# Altium schematic sheet Fuente 0-30V 0-2A.Sheet .SchDoc
size A4
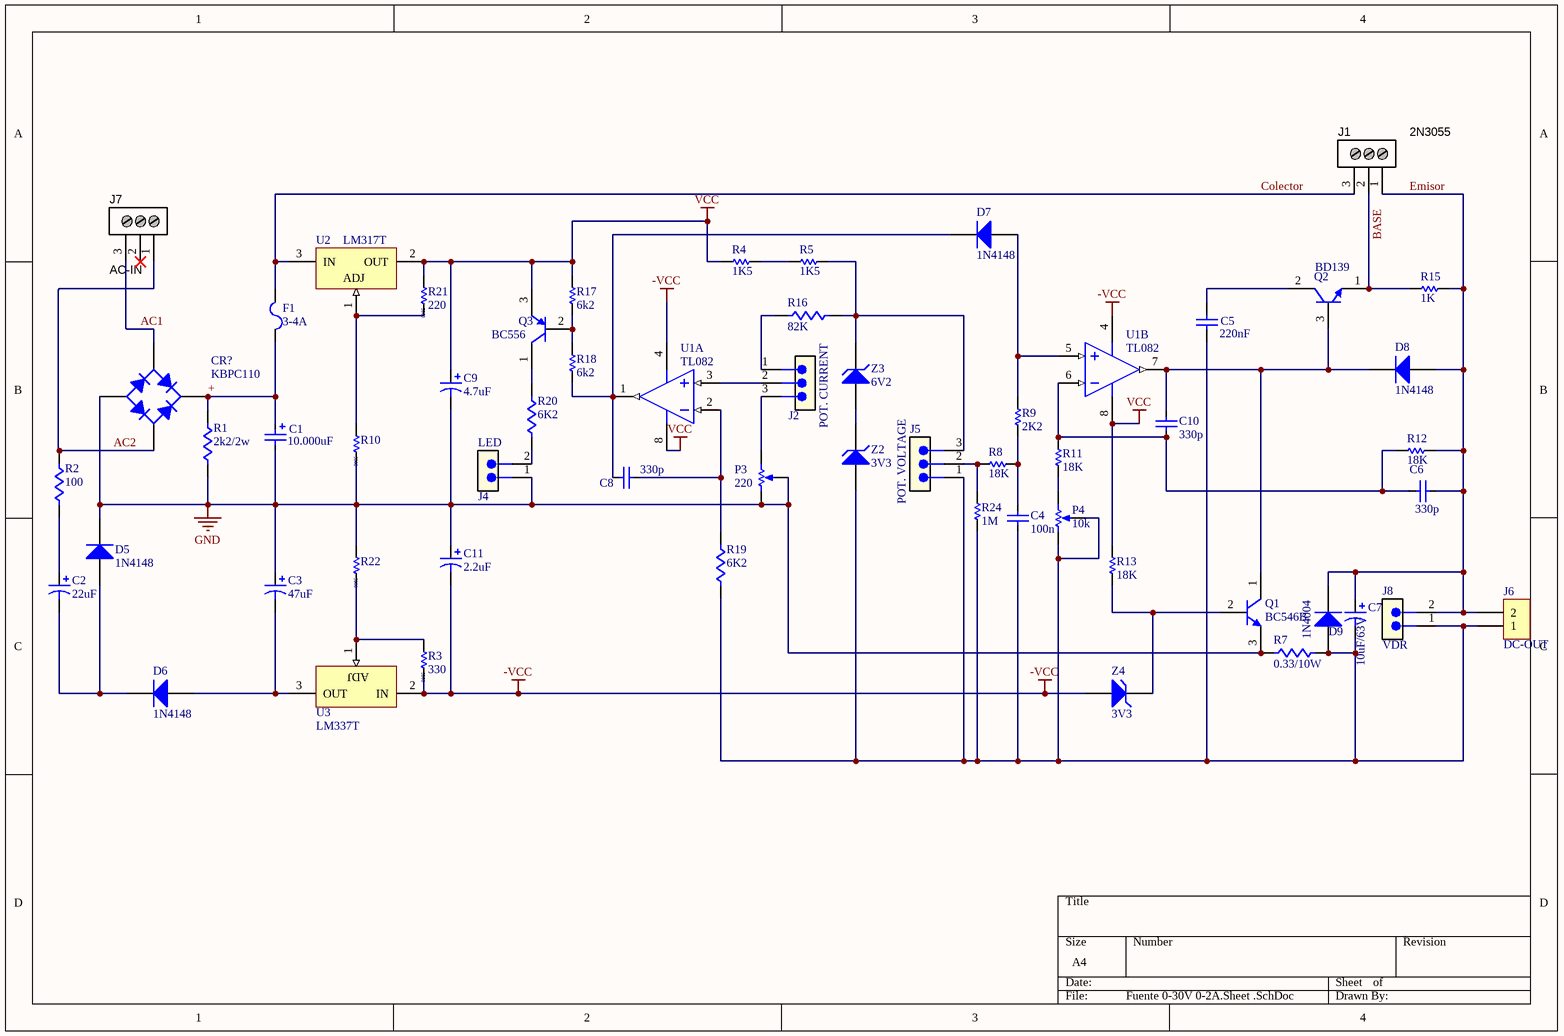
[diagram p0: Fuente 0-30V 0-2A.Sheet .SchDoc]

## Parts
C1  10.000uF  [C10000uF]
C2  22uF  [A]
C3  47uF  [A]
C4  100n  [0805 - CAP]
C5  220nF  [VP31-2.5]
C6  330p  [0805 - CAP]
C7  10uF/63V  [A]
C8  330p  [0805 - CAP]
C9  4.7uF  [A]
C10  330p  [0805 - CAP]
C11  2.2uF  [A]
CR?  KBPC110  [D-46_3A]
D5  1N4148  [GRZZ0002ZB-A]
D6  1N4148  [GRZZ0002ZB-A]
D7  1N4148  [GRZZ0002ZB-A]
D8  1N4148  [GRZZ0002ZB-A]
D9  1N4004  [GRZZ0002ZB-A]
F1  3-4A  [FUSE]
J1  Supplier Part Number 1: 2N3055  [3P_PCB_ScrewTerm_90S_3.81MM]  (hidden comment: Stackable ScrewTerm)
J2  POT. CURRENT  [HEADER3X1]
J4  LED  [HEADER2X1]
J5  POT. VOLTAGE  [HEADER3X1]
J6  DC-OUT  [CONECTEUR 2POS - duplicate]
J7  Supplier Part Number 1: AC-IN  [3P_PCB_ScrewTerm_90S_3.81MM]  (hidden comment: Stackable ScrewTerm)
J8  VDR  [HEADER2X1]
P3  value 220  [VR5]  (hidden comment: RPot)
P4  value 10k  [VR5]  (hidden comment: RPot)
Q1  BC546B  [ONSC-TO-92-3-29-11]
Q2  BD139  [ONSC-TO-225-3-77-09]
Q3  BC556  [ONSC-TO-92-3-29-11]
R1  2k2/2w  [Res 10K]
R2  100  [Res 10K]
R3  330  Package: 0805  [0805 - RES]
R4  1K5  [0805 - RES]
R5  1K5  [0805 - RES]
R7  Resistance: 0.33/10W  [Resistor_poten]  (hidden comment: POTENCIA)
R8  18K  [0805 - RES]
R9  2K2  [0805 - RES]
R10  Package: 0805  [0805 - RES]
R11  18K  [0805 - RES]
R12  18K  [0805 - RES]
R13  18K  [0805 - RES]
R15  1K  [0805 - RES]
R16  82K  [res5mm]
R17  6k2  [0805 - RES]
R18  6k2  [0805 - RES]
R19  6K2  [res5mm]
R20  6K2  [res5mm]
R21  220  Package: 0805  [0805 - RES]
R22  Package: 0805  [0805 - RES]
R24  1M  [0805 - RES]
U1  TL082  [TI-P8]  (parts A,B of 2)
U2  LM317T  [T03B]
U3  LM337T  [T03B]
Z2  3V3  [GRZZ0002ZB-A]
Z3  6V2  [GRZZ0002ZB-A]
Z4  3V3  [GRZZ0002ZB-A]

## Nets
-VCC: C11.2 R3.1 U1.4(VCC-) U3.2(IN) Z4.2(A)
GND: C1.1 C3.1 C9.2 C11.1 CR?.3(A) D5.1(K) J4.1 P3.1 P3.2 Q1.3(E) R1.2 R7.2 R10.1 R22.2
VCC: C9.1 Q3.3(E) R4.2 R13.1 R17.2 R21.2 U1.8(VCC+) U2.2(OUT)
+: C1.2 CR?.1(K) F1.1 R1.1
AC1: CR?.4(C) J7.3
AC2: CR?.2(C) J7.1 R2.1
BASE: J1.2 Q2.1(E) R15.1
Colector: F1.2 J1.3 U2.3(IN)
Emisor: C6.2 C7.1 D8.2(A) D9.1(K) J1.1 J6.2 J8.2 R12.2 R15.2
NetC2_1: C2.1 R2.2
NetC2_2: C2.2 D5.2(A) D6.1(K)
NetC3_2: C3.2 D6.2(A) U3.3(OUT)
NetC4_1: C4.1 C5.1 C7.2 D9.2(A) J5.1 J6.1 J8.1 P4.1 P4.2 R7.1 R19.1 R24.2 Z2.2(A)
NetC4_2: C4.2 R8.1 R9.2
NetC5_2: C5.2 Q2.2(C)
NetC6_1: C6.1 C10.1 R11.1 R12.1 U1.6(IN2-)
NetC8_1: C8.1 D7.1(K) R18.1 U1.1(OUT1)
NetC8_2: C8.2 R19.2 U1.2(IN1-)
NetC10_2: C10.2 D8.1(K) Q1.1(C) Q2.3(B) U1.7(OUT2)
NetD7_2: D7.2(A) R9.1 U1.5(IN2+)
NetJ2_1: J2.1 R16.1
NetJ2_2: J2.2 U1.3(IN1+)
NetJ2_3: J2.3 P3.3
NetJ4_2: J4.2 R20.1
NetJ5_2: J5.2 R8.2 R24.1
NetJ5_3: J5.3 R5.1 R16.2 Z3.1(K)
NetP4_3: P4.3 R11.2
NetQ1_2: Q1.2(B) R13.2 Z4.1(K)
NetQ3_1: Q3.1(C) R20.2
NetQ3_2: Q3.2(B) R17.1 R18.2
NetR3_2: R3.2 R22.1 U3.1(ADJ)
NetR4_1: R4.1 R5.2
NetR10_2: R10.2 R21.1 U2.1(ADJ)
NetZ2_1: Z2.1(K) Z3.2(A)

Not connected (* = marked no-connect by the designer): J7 2*

## Library data of the parts
C1 = CAPE 10000uF: CAPACITANCE: C?; VOLTAGE: V
C2 C3 C7 C9 C11 = 94SC105X0016ABP: Solid Aluminum Capacitor with Organic Semiconductor Electrolyte: 1uF, 16V, Bulk Pack; Note: Part Numbers shown are for ± 20% capacitance tolerance (X0).; PCB_Layout: Complies with Manufacturer's Recommendation.; DrillSize: Nominal, Rounded to the nearest 0.1mm; Published: 19-Mar-2004; DatasheetDocument: 23-May-2001; PackageReference: A; Publisher: Altium Limited; ComponentLink1Description: Manufacturer Link; ComponentLink1URL: http://www.vishay.com/; ComponentLink2Description: Datasheet; ComponentLink2URL: http://www.vishay.com/docs/90004/94sc.pdf; Value: 1uF
C4 C6 C8 C10 = CAP_0805: Package: 0805
C5 = VP31BA100JA: Dipped Radial Multilayer Ceramic Capacitor COG (NPO): 10pF, 50/63V; Note: See Datasheet for other packages & tolerances; Published: 17-Dec-2003; DatasheetDocument: 2-Jan-2002; PackageDocument: 8-Feb-2002; PackageReference: VP31-2.5; Publisher: Altium Limited; ComponentLink1Description: Manufacturer Link; ComponentLink1URL: http://www.vishay.com/; Value: 10pF
CR? = KBPC110: 3 Amp Single Phase Rectifier Bridge; Published: 8-Jun-2000; LatestRevisionDate: 17-Jul-2002; LatestRevisionNote: Re-released for DXP Platform.; DatasheetVersion: E2574A; PackageReference: D-46_3A; Publisher: Altium Limited; PackageDescription: Bridge Rectifier; 4 Terminals; Body 16.8 x 16.8 mm (typ); Pitch 10.67 mm; ComponentLink1Description: Manufacturer Link; ComponentLink1URL: http://www.irf.com/; ComponentLink2Description: Datasheet; ComponentLink2URL: http://www.irf.com/product-info/datasheets/data/kbpc1.pdf
D5-D9 = 1N4148: Silicon Epitaxial Planar Diode for Various Detector, Modulator, Demodulator; Published: 12-Feb-2010; DatasheetVersion: Rev.5.00, Jul-2006; PackageVersion: Aug-2005; PackageReference: GRZZ0002ZB-A; Publisher: Altium Limited; PackageDescription: Diode, Axial; Body 4.2 x 2.0 mm (LxDia.), Lead Dia. 0.5 mm (nom); Code_JEITA: SC-40; ComponentLink1Description: Manufacturer Link; ComponentLink1URL: http://sg.renesas.com/fmwk.jsp?cnt=diode_landing.jsp&fp=/products/discrete/diodes/; ComponentLink2Description: Datasheet; ComponentLink2URL: http://documentation.renesas.com/eng/products/diode/rej03g0556_1n4148.pdf; ComponentLink3Description: Packaging Specification; ComponentLink3URL: http://sg.renesas.com/media/products/common_info/package/pdf/diode/code/grzz0002zb_a.pdf
F1 = FUSE: FUSE_GENERIC_RADIAL
J1 J7 = BOR 1X3: Terminal Block Screw Type THT 2-Position 3.81mm pitch; Manufacturer 1: Tyco Electronics; Manufacturer Part Number 1: 1776113-2; Value: 2 position; Pitch: 0.150" (3.81mm); Positions Per Level: 2; Package / Case: Side Entry; 3.81mm pitch; Category: Connectors Interconnects; Color: Black; Supplier 1: Digi-Key
J2 J5 = HEADER 3X1
J4 J8 = HEADER 2X1: Header recto M 100 mils pitch 2x1; Manufacturer: Harwin; PartNumber: M20-9 73 02 46; ComponentStatus: Active; Contacts: 2; EM_Case: NA; Gender: Male; Imax: 3 A; INVAPDescriptionEN: Header, Male, Male, 2, NA; INVAPDescriptionES: Header, Macho, Male, 2, NA; Notes: Corresponde a corte de una tira de 40, se utilizará el equivalente disponible en depósito, HDSIF19040GT; SolderingType: Manual; SubTypeES: Macho; Vmax: 800 V; Case: NA; Category: Conventional; DatasheetURL: https://cdn.harwin.com/pdfs/Harwin_PC_Connectors_M20.pdf; EM_Manufacturer: NA; EM_Mfr_PartNum: NA; EM_Mfr_Reel_PartNum: NA; FM_Case: NA; FM_Manufacturer: NA; FM_Mfr_PartNum: NA; FM_Mfr_Reel_PartNum: NA; Footprint_INVAP: HEADER2X1; MilitarySTD: NA; Mil_PartNum: NA; MountingType: TH; Reel_PartNumber: NA; SubTypeEN: Male; TempMax: 105 °C; TempMin: -40 °C; TypeEN: Header; TypeES: Header; Weight: 0,12 gr; CM_Case: NA; CM_Manufacturer: Harwin; CM_Mfr_PartNum: M20-9 73 02 46; CM_Mfr_Reel_PartNum: NA; CM_Notes: Corresponde a corte de una tira de 40, se utilizará el equivalente disponible en depósito, HDSIF19040GT; EM_Notes: NA; FM_Notes: NA
J6 = CON 1x2: CONECTOR 2P
P3 P4 = RPot: Potentiometer; Sim Note: Enter the Resistance value and the set point into parameter fields.; Set Position: 0.5; Published: 8-Jun-2000; LatestRevisionDate: 17-Jul-2002; LatestRevisionNote: Re-released for DXP Platform.; PackageReference: VR5; Publisher: Altium Limited
Q1 = BC546B: Amplifier Transistor, NPN Silicon, 3-Pin TO-92, Bulk Box; Manufacturer: On Semiconductor; Note: 0; fT Min (MHz): 150; IC Continuous (A): 0.1; DatasheetVersion: Rev. 7; PackageVersion: Rev. AM; PackageReference: TO-92-3-29-11_AM_SL; PackageDescription: 3-Pin Transistor Outline, Body 4.825 x 3.685 mm, Pitch 1.27 mm; Packing: Bulk Box; Polarity: NPN; RoHS: FALSE; Mounting Technology: Through Hole; PartNumber: BC546B; ComponentLink1Description: Manufacturer URL; ComponentLink1URL: http://www.onsemi.com/; ComponentLink2Description: Datasheet; ComponentLink2URL: http://www.onsemi.com/pub_link/Collateral/BC546-D.PDF; ComponentLink3Description: Package Specification; ComponentLink3URL: http://www.onsemi.cn/pub_link/Collateral/2N6426-D.PDF
Q2 = BD139: Plastic Medium-Power Silicon NPN Transistor, 3-Pin TO-225, Bulk Box; Manufacturer: On Semiconductor; IC Continuous (A): 1.5; DatasheetVersion: Rev. 16; PackageVersion: Rev. AC, 12/2013; PackageReference: TO-225-3-77-09; PackageDescription: 3-Pin Flange Mount, Vertical Straight Lead, Body 7.6 x 2.7 mm, Pitch 2.29 mm; Supplier 1: Digi-Key; Supplier Part Number 1: BD139OS-ND; Packing: Bulk Box; Polarity: NPN; RoHS: FALSE; Mounting Technology: Through Hole; PartNumber: BD139; ComponentLink1Description: Manufacturer URL; ComponentLink1URL: http://www.onsemi.com/; ComponentLink2Description: Datasheet; ComponentLink2URL: http://www.onsemi.com/pub_link/Collateral/BD135-D.PDF; ComponentLink3Description: Package Specification; ComponentLink3URL: http://www.onsemi.com/pub_link/Collateral/77-09.PDF
Q3 = BC556BG: Amplifier Transistor, PNP Silicon, 3-Pin TO-92, Pb-Free, Bulk Box; Manufacturer: On Semiconductor; IC Continuous (A): -0.1; DatasheetVersion: Rev. 3; PackageVersion: Rev. AM; PackageReference: TO-92-3-29-11_AM_SL; PackageDescription: 3-Pin Transistor Outline, Body 4.825 x 3.685 mm, Pitch 1.27 mm; Supplier 1: Digi-Key; Supplier Part Number 1: BC556BGOS-ND; Supplier 2: Newark; Supplier Part Number 2: 26K3439; Supplier 3: Mouser; Supplier Part Number 3: 863-BC556BG; Packing: Bulk Box; Polarity: PNP; RoHS: TRUE; Mounting Technology: Through Hole; PartNumber: BC556BG; ComponentLink1Description: Manufacturer URL; ComponentLink1URL: http://www.onsemi.com/; ComponentLink2Description: Datasheet; ComponentLink2URL: http://www.onsemi.com/pub_link/Collateral/BC556B-D.PDF; ComponentLink3Description: Package Specification; ComponentLink3URL: http://www.onsemi.cn/pub_link/Collateral/2N6426-D.PDF
R1 R2 = Res 10K: R1206; Tolerance: %; Power: W; Package: 1206
  R1: Resistance: 2k2/2w
  R2: Resistance: 100
R3-R5 R8-R13 R15 R17 R18 R21 R22 R24 = RES_0805
  R4 R5 R8 R9 R11-R13 R15 R17 R18 R24: Package: 0805
R7 = RES_POTEN: R1206; Tolerance: %; Power: W; Package: 1206
R16 R19 R20 = Res 5mm: 5mm; Tolerance: %; Power: W; Package: 1206
  R16: Resistance: 82K
  R19 R20: Resistance: 6K2
U1 = TL082ACP: JFET-Input Operational Amplifier, 7 to 36 V, 0 to 70 degC, 8-pin DIP (P8), Pb-Free (RoHS); Manufacturer: Texas Instruments; CMRR(Min)(dB): 75; GBW(Typ)(MHz): 3; IIB(Max)(pA): 200; Iq per channel(Max)(mA): 2.8; Number of Channels: 2; Offset Drift(Typ)(uV/C): 18; Rating: Catalog; Slew Rate(Typ)(V/us): 13; Sub Family: General Purpose Amplifier, High Supply Voltage Amplifier (>=30V); Total Supply Voltage(Max)(+5V is 5, +/-5V is 10): 36; Total Supply Voltage(Min)(+5V is 5, +/-5V is 10): 7; Vio (25C)(Max)(mV): 6; DatasheetVersion: SLOS081G; PackageVersion: 4040082/E, 04/2010; PackageReference: P8; PackageDescription: 8-Pin Plastic In-Line, Body 9.59 x 6.35 mm, Pitch 2.54 mm; Supplier 1: Digi-Key; Supplier Part Number 1: 296-1778-5-ND; Supplier 2: Farnell; Supplier Part Number 2: 1103189; Supplier 3: Newark; Supplier Part Number 3: 08F9330; Supplier 4: Mouser; Supplier Part Number 4: 595-TL082ACP; Eco-Plan: Pb-Free (RoHS); Vn at 1kHz(Typ)(nV/rtHz): 18; Mounting Technology: Through Hole; Code_JEDEC: MS-001; PartNumber: TL082ACP; ComponentLink1Description: Manufacturer URL; ComponentLink1URL: http://www.ti.com/; ComponentLink2Description: Datasheet; ComponentLink2URL: http://www.ti.com/lit/ds/symlink/tl082a.pdf; ComponentLink3Description: Package Specification; ComponentLink3URL: http://www.ti.com/litv/pdf/mpdi001b
U2 = LM317T: 3-Terminal Adjustable Regulator, 3-pin TO-220; Manufacturer: National Semiconductor; PackageTopMarking: NSUZXYTTE#*LM317T P+; PowerWise: N; CompType: LDO IC; High-Reliability: Y; DatasheetVersion: Apr-2007; PackageVersion: revL, Jan-1992; PackageReference: T03B; PackageDescription: TO-220, Molded, 3 Lead, Straight; PartNumber: LM317T; RoHS: N; PinCount: 3; ComponentLink1Description: Manufacturer URL; ComponentLink1URL: http://www.national.com/; ComponentLink2Description: LM317 Datasheet; ComponentLink2URL: http://www.national.com/ds/LM/LM317.pdf; ComponentLink3Description: LM317 Web Page; ComponentLink3URL: http://www.national.com/pf/LM/LM317.html; ComponentLink4Description: T03B Package Page; ComponentLink4URL: http://www.national.com/packaging/folders/t03b.html
U3 = LM337T: 3-Terminal Adjustable Negative Regulator, 3-pin TO-220; Manufacturer: National Semiconductor; PackageTopMarking: NSUZXYTTE#*LM337T P+; PowerWise: N; CompType: LDO IC; High-Reliability: Y; DatasheetVersion: Nov-2004; PackageVersion: revL, Jan-1992; PackageReference: T03B; PackageDescription: TO-220, Molded, 3 Lead, Straight; PartNumber: LM337T; RoHS: N; PinCount: 3; ComponentLink1Description: Manufacturer URL; ComponentLink1URL: http://www.national.com/; ComponentLink2Description: LM337 Datasheet; ComponentLink2URL: http://www.national.com/ds/LM/LM337.pdf; ComponentLink3Description: LM337 Web Page; ComponentLink3URL: http://www.national.com/pf/LM/LM337.html; ComponentLink4Description: T03B Package Page; ComponentLink4URL: http://www.national.com/packaging/folders/t03b.html
Z2-Z4 = HZ2C1-N: Silicon Planar Zener Diode for Stabilized Power Supply; Published: 12-Feb-2010; DatasheetVersion: Rev.1.00, Mar-2008; PackageVersion: Aug-2005; PackageReference: GRZZ0002ZB-A; Publisher: Altium Limited; PackageDescription: Diode, Axial; Body 4.2 x 2.0 mm (LxDia.), Lead Dia. 0.5 mm (nom); Code_JEITA: SC-40; ComponentLink1Description: Manufacturer Link; ComponentLink1URL: http://sg.renesas.com/fmwk.jsp?cnt=diode_landing.jsp&fp=/products/discrete/diodes/; ComponentLink2Description: Datasheet; ComponentLink2URL: http://documentation.renesas.com/eng/products/diode/rej03g1625_hz_nds.pdf; ComponentLink3Description: Packaging Specification; ComponentLink3URL: http://sg.renesas.com/media/products/common_info/package/pdf/diode/code/grzz0002zb_a.pdf